# Altium schematic sheet 2014-09-02_05-44-381.schdoc
size 339 x 139 mm; SheetNumber: 1; SheetTotal: 1
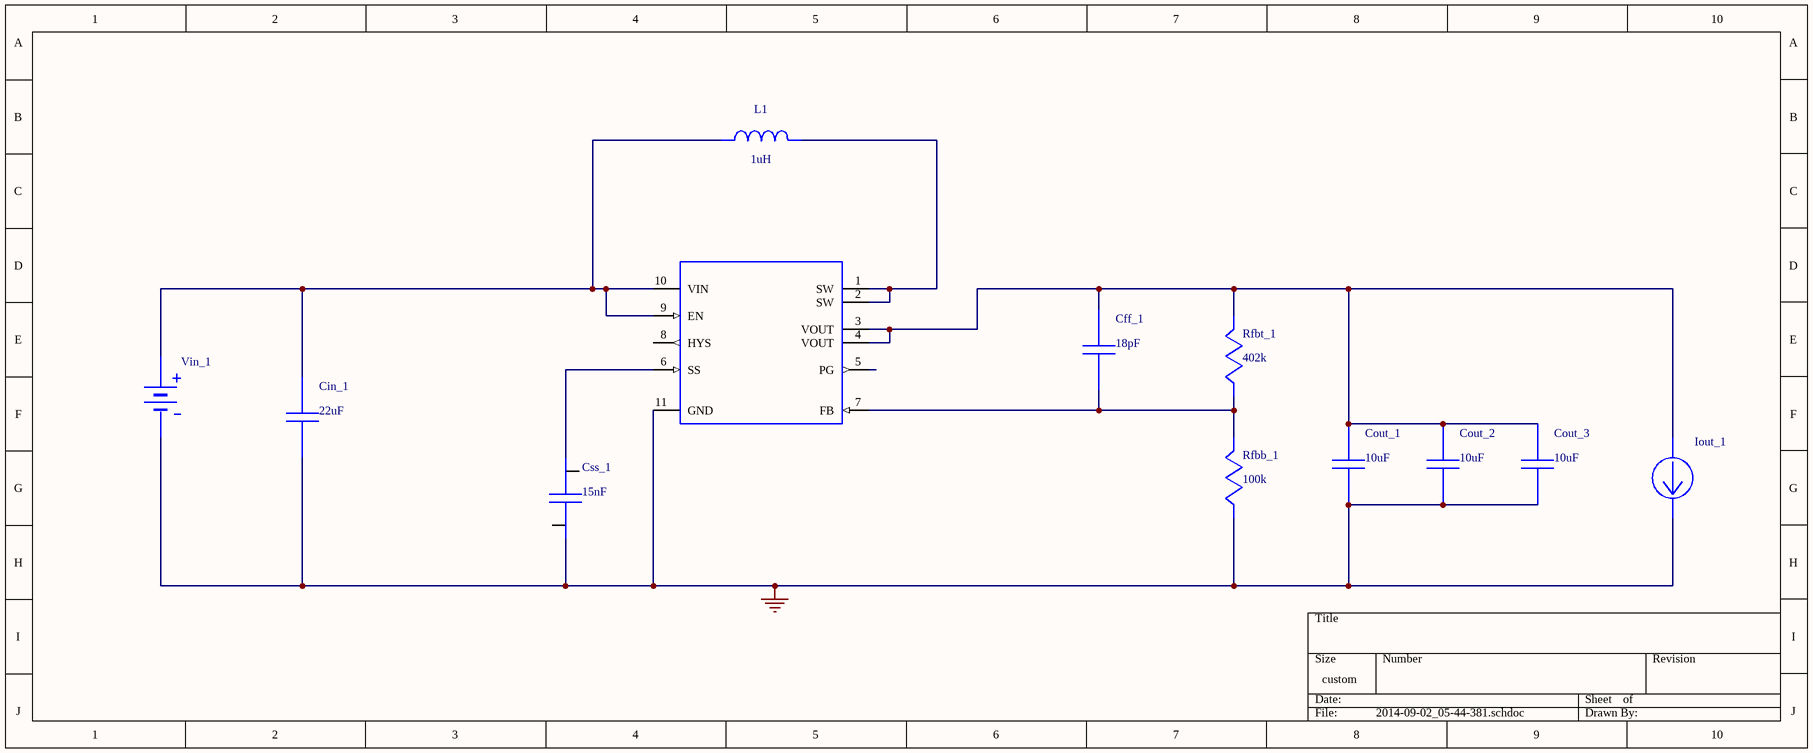
[diagram p0: 2014-09-02_05-44-381.schdoc]

## Parts
Cff_1  value 18pF  (hidden comment: C0603C180J5GACTU)
Cin_1  value 22uF  (hidden comment: C2012X5R0J226M)
Cout_1  value 10uF  (hidden comment: GRM21BR61A106KE19L)
Cout_2  value 10uF  (hidden comment: GRM21BR61A106KE19L)
Cout_3  value 10uF  (hidden comment: GRM21BR61A106KE19L)
Css_1  value 15nF  (hidden comment: GRM155R71C153KA01D)
Iout_1  WB_CURRENT_LOAD  (value not drawn)
L1  value 1uH  (hidden comment: SRU1028-1R0Y)
Rfbb_1  value 100k  (hidden comment: CRCW0402100KFKED)
Rfbt_1  value 402k  (hidden comment: CRCW0402402KFKED)
U1  TPS61230DRCR  (value not drawn)
Vin_1  WB_BATTERY  (value not drawn)

## Nets
0: Cin_1.2 Cout_1.2 Cout_2.2 Cout_3.2 Iout_1.2(-) Rfbb_1.2 U1.11(GND) Vin_1.2(-)
NetCff_1_1: Cff_1.1 Cout_1.1 Cout_2.1 Cout_3.1 Iout_1.1(+) Rfbt_1.1 U1.3(VOUT) U1.4(VOUT)
NetCff_1_2: Cff_1.2 Rfbb_1.1 Rfbt_1.2 U1.7(FB)
NetCin_1_1: Cin_1.1 L1.2 U1.9(EN) U1.10(VIN) Vin_1.1(+)
NetL1_1: L1.1 U1.1(SW) U1.2(SW)

Not connected (* = marked no-connect by the designer): Css_1 1 2; U1 5(PG) 6(SS) 8(HYS)

## Library data of the parts
Cff_1 = C0603C180J5GACTU: Manufacturer Name: Kemet; PackageReference: C0603C180J5GACTU; Manufacturer Part Number: C0603C180J5GACTU
Cin_1 = C2012X5R0J226M: Manufacturer Name: TDK; PackageReference: C2012X5R0J226M; Manufacturer Part Number: C2012X5R0J226M
Cout_1-Cout_3 = GRM21BR61A106KE19L: GRM21BR61A106KE1; Manufacturer Name: MuRata; PackageReference: GRM21BR61A106KE19L; Manufacturer Part Number: GRM21BR61A106KE19L
Css_1 = GRM155R71C153KA01D: GRM155R71C153KA0; Manufacturer Name: MuRata; PackageReference: GRM155R71C153KA01D; Manufacturer Part Number: GRM155R71C153KA01D
Iout_1 = WB_CURRENT_LOAD: Value: UNLISTED; PackageReference: WB_CURRENT_LOAD; Manufacturer Part Number: WB_CURRENT_LOAD; Manufacturer Name: WB_CURRENT_LOAD
L1 = SRU1028-1R0Y: Manufacturer Name: Bourns; PackageReference: SRU1028-1R0Y; Manufacturer Part Number: SRU1028-1R0Y
Rfbb_1 = CRCW0402100KFKED: Manufacturer Name: Vishay-Dale; PackageReference: CRCW0402100KFKED; Manufacturer Part Number: CRCW0402100KFKED
Rfbt_1 = CRCW0402402KFKED: Manufacturer Name: Vishay-Dale; PackageReference: CRCW0402402KFKED; Manufacturer Part Number: CRCW0402402KFKED
U1 = TPS61230DRCR: Manufacturer Name: Texas Instruments; PackageReference: Type; Manufacturer Part Number: TPS61230DRCR; Value: Value
Vin_1 = WB_BATTERY: Value: UNLISTED; PackageReference: WB_BATTERY; Manufacturer Part Number: WB_BATTERY; Manufacturer Name: WB_BATTERY